# Altium project TPS552882_testpcb.PrjPcb
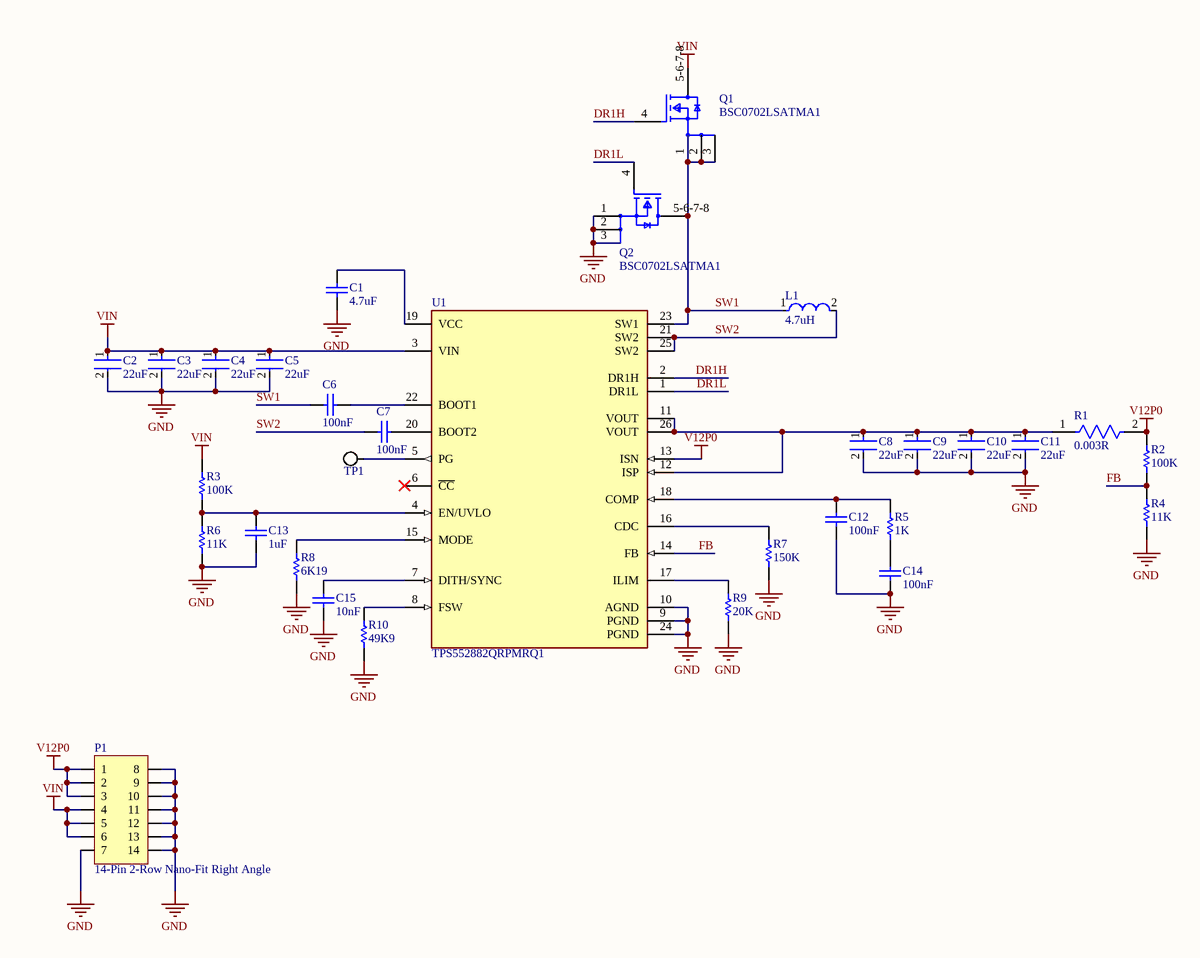
[diagram p0: TPS552882_SCH.SchDoc]
1 sheet, 31 parts. Net scope: global (net labels, ports and power ports of the same name join across sheets).
Board file: TPS552882_PCB.PcbDoc

## Sheet TPS552882_SCH.SchDoc
size B; SheetNumber: 1; SheetTotal: 1

### Parts
C1  4.7uF  [CAPC1608X87X35NL15T15]
C2  22uF  [FP-GRM32E-0_3-0_2-MFG]
C3  22uF  [FP-GRM32E-0_3-0_2-MFG]
C4  22uF  [FP-GRM32E-0_3-0_2-MFG]
C5  22uF  [FP-GRM32E-0_3-0_2-MFG]
C6  100nF  [0603]
C7  100nF  [0603]
C8  22uF  [FP-GRM32E-0_3-0_2-MFG]
C9  22uF  [FP-GRM32E-0_3-0_2-MFG]
C10  22uF  [FP-GRM32E-0_3-0_2-MFG]
C11  22uF  [FP-GRM32E-0_3-0_2-MFG]
C12  100nF  [0603]
C13  1uF  [0603]
C14  100nF  [0603]
C15  10nF  [CAPC1608X90X35ML10T15]
L1  4.7uH  [FP-IHLP-5050EZ-FP_3_226x4-MFG]
P1  14-Pin 2-Row Nano-Fit Right Angle  [MOLEX NANO-FIT 2X7 - Right Angle]
Q1  BSC0702LSATMA1  [FP-PG-TDSON-8-MFG]
Q2  BSC0702LSATMA1  [FP-PG-TDSON-8-MFG]
R1  0.003R  [FP-CRE2512-R001-R004-MFG]
R2  100K  [0603]
R3  100K  [0603]
R4  11K  [RESC1609X50X30ML10T20]
R5  1K  [RESC1608X55X30LL15T15]
R6  11K  [RESC1609X50X30ML10T20]
R7  150K  [RESC1608X55X30NL15T15]
R8  6K19  [RESC1609X50X30NL10T20]
R9  20K  [RESC1609X50X30ML10T20]
R10  49K9  [RESC1609X55X30ML10T20]
TP1  Test Point Pad  [Test Point Pad]  (value not drawn)
U1  TPS552882QRPMRQ1  [FP-RPM0026A-MFG]

### Nets
GND: C1.1 C2.2 C3.2 C4.2 C5.2 C8.2 C9.2 C10.2 C11.2 C12.2 C13.1 C14.2 C15.1 P1.7 P1.8 P1.9 P1.10 P1.11 P1.12 P1.13 P1.14 Q2.1(Source) Q2.2(Source) Q2.3(Source) R4.1 R6.1 R7.2 R8.1 R9.2 R10.1 U1.9(PGND) U1.10(AGND) U1.24(PGND)
V12P0: P1.1 P1.2 P1.3 R1.2 R2.1 U1.13(ISN)
VIN: C2.1 C3.1 C4.1 C5.1 P1.4 P1.5 P1.6 Q1.5-6-7-8(Drain) R3.1 U1.3(VIN)
DR1H: Q1.4(Gate) U1.2(DR1H)
DR1L: Q2.4(Gate) U1.1(DR1L)
FB: R2.2 R4.2 U1.14(FB)
SW1: C6.2 L1.1 Q1.1(Source) Q1.2(Source) Q1.3(Source) Q2.5-6-7-8(Drain) U1.23(SW1)
SW2: C7.2 L1.2 U1.21(SW2) U1.25(SW2)
NetC1_2: C1.2 U1.19(VCC)
NetC6_1: C6.1 U1.22(BOOT1)
NetC7_1: C7.1 U1.20(BOOT2)
NetC8_1: C8.1 C9.1 C10.1 C11.1 R1.1 U1.11(VOUT) U1.12(ISP) U1.26(VOUT)
NetC12_1: C12.1 R5.2 U1.18(COMP)
NetC13_2: C13.2 R3.2 R6.2 U1.4(EN/UVLO)
NetC14_1: C14.1 R5.1
NetC15_2: C15.2 U1.7(DITH/SYNC)
NetR7_1: R7.1 U1.16(CDC)
NetR8_2: R8.2 U1.15(MODE)
NetR9_1: R9.1 U1.17(ILIM)
NetR10_2: R10.2 U1.8(FSW)
NetTP1_1: TP1.1 U1.5(PG)

Not connected (* = marked no-connect by the designer): U1 6(~{CC})*

### Library data of the parts
C1 = CMP-2006-03238-1: C0603C475K8PACTU / 4.7uf 0603; Manufacturer: Kemet; Part Number: C0603C475K8PACTU
C2-C5 C8-C11 = CMP-1662-00021-2: Chip Multilayer Ceramic Capacitors for General Purpose, 1210, 22uF, X7R, 15%, 10%, 25V / GRM32ER71E226KE15L; Capacitance: 22uF; Lead Free: Lead Free; Depth: 2.5mm; Mount: Surface Mount; Termination: SMD/SMT; Radiation Hardening: No; Package Quantity: 1; Dielectric: X7R; REACH SVHC: No SVHC; Voltage: 25V; Voltage Rating: 25V; Case Code (Metric): 3225; Tolerance: 10%; Number of Pins: 2; Packaging: Tape and Reel; Thickness: 0.106inch; Min Operating Temperature: -55°C; Length: 3.2mm; Voltage Rating (DC): 25V; Width: 0.098inch; Height: 2.5mm; Case Code (Imperial): 1210; Max Operating Temperature: 125°C; Material: Ceramic; Case/Package: 1210
C6 C7 C12 C14 = 100nF 0603: CAP 100nF 100V ±10% 0603 (1608 Metric) Thickness 1mm SMD; Tolerance: Â±10%; Case-Metric: 1608; Rated Voltage: 100 V; Case-EIA: 0603; Value: 100nF; Technology: SMT; Max Thickness: 1 mm; ComponentLink1Description: Link; ComponentLink1URL: https://www.digikey.com/en/products/detail/samsung-electro-mechanics/CL10B104KC8NNNC/5961291
C13 = 1uF 0603: CAP 1uF 25V ±10% 0603 (1608 Metric) Thickness 1mm SMD; Tolerance: Â±10%; Case-Metric: 1608; Technology: SMT; Rated Voltage: 25 V; Case-EIA: 0603; Max Thickness: 1 mm; Value: 1uF; ComponentLink1Description: Link; ComponentLink1URL: https://www.digikey.com/en/products/detail/samsung-electro-mechanics/CL10B105KA8NNNC/3886842
C15 = CMP-2100-03642-1: Chip Capacitor, 10 nF, +/- 10%, 50 V, -55 to 125 degC, 0603 (1608 Metric), RoHS, Tape and Reel / GRM188R71H103KA01D; Manufacturer: Murata; Insulation Resistance: 10GR; Dielectric: X7R; Voltage Rating: 50V; Material: Ceramic; Package Quantity: 1; Lead Free: LeadFree; Case/Package: 0603; Termination: SMD/SMT; REACH SVHC: Unknown; Manufacturer URL: http://www.murata.com/; Datasheet URL: http://search.murata.co.jp/Ceramy/image/img/A01X/G101/ENG/GRM188R71H103KA01-01.pdf; Mount: SurfaceMount; Datasheet Version: 42401.0; Number of Pins: 2; Length: 1.6mm; Voltage: 50V; Depth: 0.8mm; Tolerance: 10%; Min Operating Temperature: -55degC; Voltage Rating (DC): 50V; Max Operating Temperature: 125degC; Package Description: 2-Pin Surface Mount Device, Body 1.6 x 0.8 mm; RoHSCompliant: True; Case Code (Imperial): 0603; Width: 0.031inch; Case Code (Metric): 1608; Height: 0.8mm; Package Reference: 0603; Packaging: TapeandReel; Thickness: 0.035inch; Capacitance: 10nF; Dielectric Material: Ceramic
L1 = CMP-02424-000658-1: Commercial Inductors, High Saturation Series 4.7uH 12A 15mΩ 20% / IHLP5050EZER4R7M01; DC Resistance (DCR): 15mR; Core Material: Ferrite; Max DC Current: 27A; Test Frequency: 100kHz; Self Resonant Frequency: 5MHz; Shielding: Shielded; Inductance: 4.7uH; Max Operating Temperature: 125°C; Inductance Tolerance: 20%; Termination: SMD/SMT; Military Standard: Not; Height: 5mm; Number of Pins: 2; Case/Package: 5050; Length: 13.7mm; Package Quantity: 250; Contact Plating: Tin; Saturation Current: 27A; Depth: 12.9mm; Tolerance: 20%; Mount: Surface Mount; Min Operating Temperature: -55°C; Radiation Hardening: No; Lead Free: Lead Free; RMS Current (Irms): 12A; Height - Seated (Max): 0.197inch; Packaging: Tape and Reel; Width: 0.508inch; Current Rating: 12A
P1 = 14-Pin 2-Row Nano-Fit Right Angle: NanoFit Right Hdr TH DR 14Ckt; Part Number: 105314-1214; Manufacturer: Molex; Supplier: Mouser; Supplier Part Number: 538-105314-1214; Supplier 1: Mouser; Supplier Part Number 1: 538-105314-1214; ComponentLink1Description: Mouser Link; ComponentLink1URL: https://www.mouser.com/ProductDetail/Molex/105314-1214?qs=PqFvFmEiOr6wLIXpvlvqbA%3D%3D; ComponentLink2Description: Link; ComponentLink2URL: https://www.digikey.com/en/products/detail/molex/1053141114/7693193
Q1 Q2 = CMP-00196-81703971-1: BSC0702LSATMA1 Transistor MOSFET N-CH 60V 100A 8-Pin TDSON T/R - Tape and Reel; Turn-Off Delay Time: 25ns; Max Junction Temperature (Tj): 150°C; Turn-On Delay Time: 7.7ns; Continuous Drain Current (ID): 23A; Number of Channels: 1; Power Dissipation: 2.5W; Gate to Source Voltage (Vgs): 20V; Drain to Source Resistance: 2.3mΩ; NexarPartId: 81703971; Drain to Source Breakdown Voltage: 60V; Max Operating Temperature: 150°C; Min Operating Temperature: -55°C; Drain to Source Voltage (Vdss): 60V; Height: 1mm
R1 = CMP-07231-007668-1: RES 0.003 OHM 1% 3W 2512 / CRE2512-FZ-R003E-3; Resistance: 3mR; Temperature Coefficient: 75ppm/°C; Mount: Surface Mount; Max Operating Temperature: 170°C; Min Operating Temperature: -55°C; Technology: METAL STRIP; Series: CRE2512; Case Code (Metric): 6432; Depth: 3.35mm; Case Code (Imperial): 2512; Width: 0.132inch; Case/Package: 2512; Packaging: Cut Tape; REACH SVHC: No SVHC; Resistance Tolerance: 1%; Termination: Solder; Tolerance: 1%; Features: Moisture Resistant; RoHS Compliant: No; Height: 0.035inch; Resistor Type: Metal Alloy; Power Rating: 3W; Number of Terminations: 2; Length: 0.254inch; Contact Plating: Tin; Max Power Dissipation: 3W
R2 R3 = 100K 0603: ERJ-3EKF1003V-100k 0603; Manufacturer: Panasonic; Part Number: ERJ-3EKF1003V; ComponentLink1Description: Link; ComponentLink1URL: https://www.digikey.com/en/products/detail/yageo/RC0603FR-07100KL/726889
R4 R6 = CMP-2000-03860-1: CRCW060311K0FKEA / 11k 0603; Manufacturer: Vishay Dale; Part Number: CRCW060311K0FKEA
R5 = CMP-2000-00180-1: ERJ-3EKF1001V / 1k 0603; Manufacturer: Panasonic; Part Number: ERJ-3EKF1001V
R7 = CMP-1012-00754-2: ERJ-3EKF1503V / 150k 0603; Manufacturer: Panasonic; Part Number: ERJ-3EKF1503V
R8 = CMP-1012-00600-2: CRCW06036K19FKEA / 6.19k 0603; Manufacturer: Vishay Dale; Part Number: CRCW06036K19FKEA
R9 = CMP-1012-00105-2: CRCW060320K0JNEA / 20k 0603; Manufacturer: Vishay Dale; Part Number: CRCW060320K0JNEA
R10 = CMP-2000-03772-1: TNPW060349K9BEEA / 49.9k 0603; Manufacturer: Vishay Dale; Part Number: TNPW060349K9BEEA
TP1 = Test Point Pad: Test point, Pad, 30 mil
U1 = CMP-04918-000720-1: 36-V, 16-A BUCK-BOOST CONVERTER, / TPS552882QWRPMRQ1 or TPS552882QRPMRQ1; RoHS Compliant: Yes